# Altium schematic sheet braking_io.SchDoc: Braking IO PCB
size A4; Organization: Badgerloop Electrical; Address1: 133 Engineering Research Building; Address2: 1500 Engineering Drive; Address3: Madison, Wi 53706
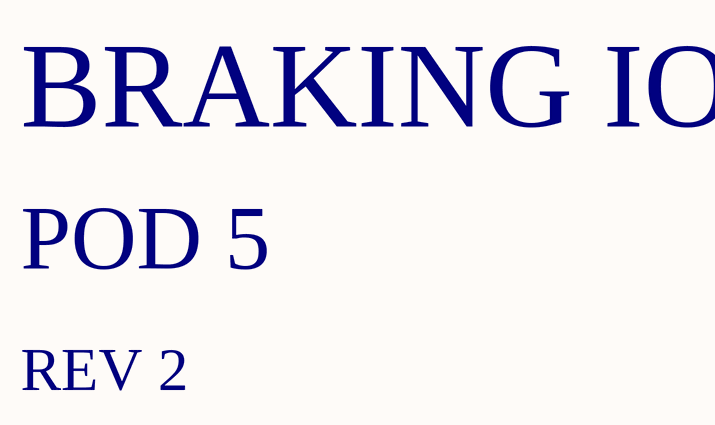
[diagram p0: braking_io.SchDoc]

## Notes on the sheet
- BRAKING IO
- POD 5
- REV 2
- Title
- Engineer:
- Date:
- Time:
- Revision:
- Sheet
- of
- File: